# EasyEDA Pro project WukongY003.eprj, schematic PT32Y003_DEMO

## Sheets
1 P1: Create Date: 2022-10-31; Page Name: P1; Project Name: WukongY003; Schematic Name: PT32Y003_DEMO; Update Date: 2022-12-28; Company: PAI-IC; Drawed: THEli; Page Size: A4; Version: V1.0
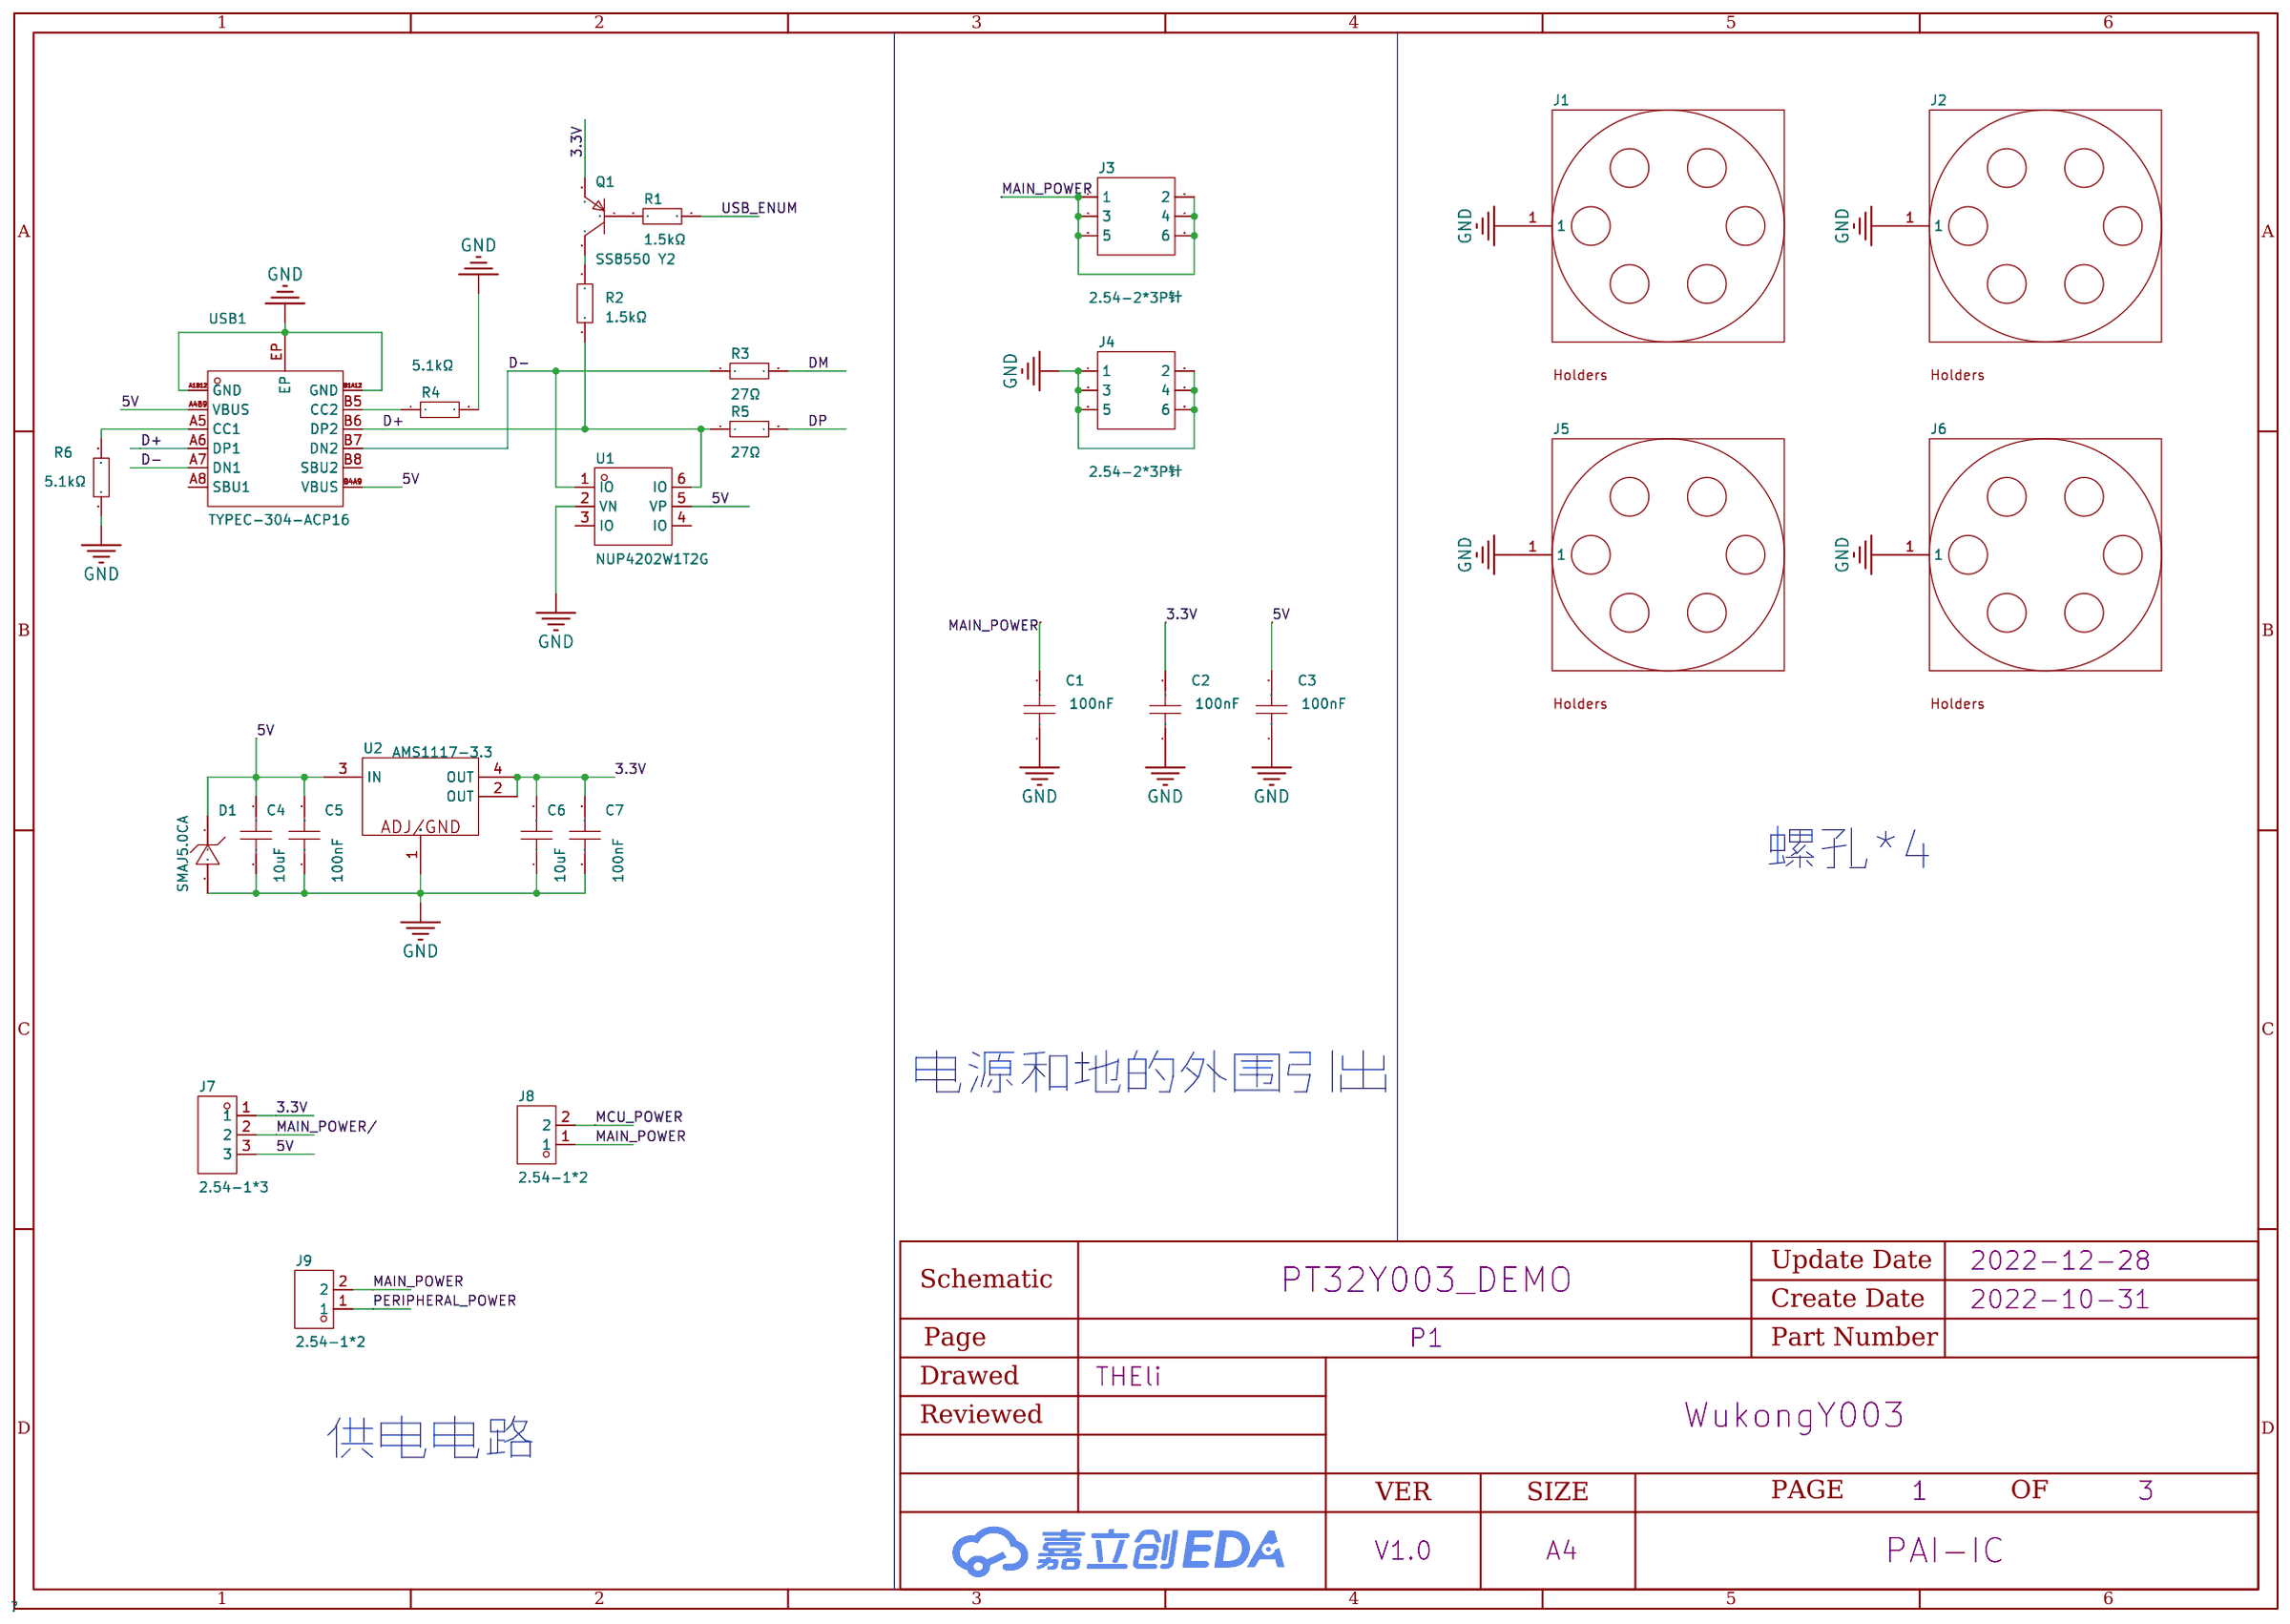
[diagram p0: P1]
2 P2: Create Date: 2022-11-01; Page Name: P2; Update Date: 2022-12-19; Company: 嘉立创EDA
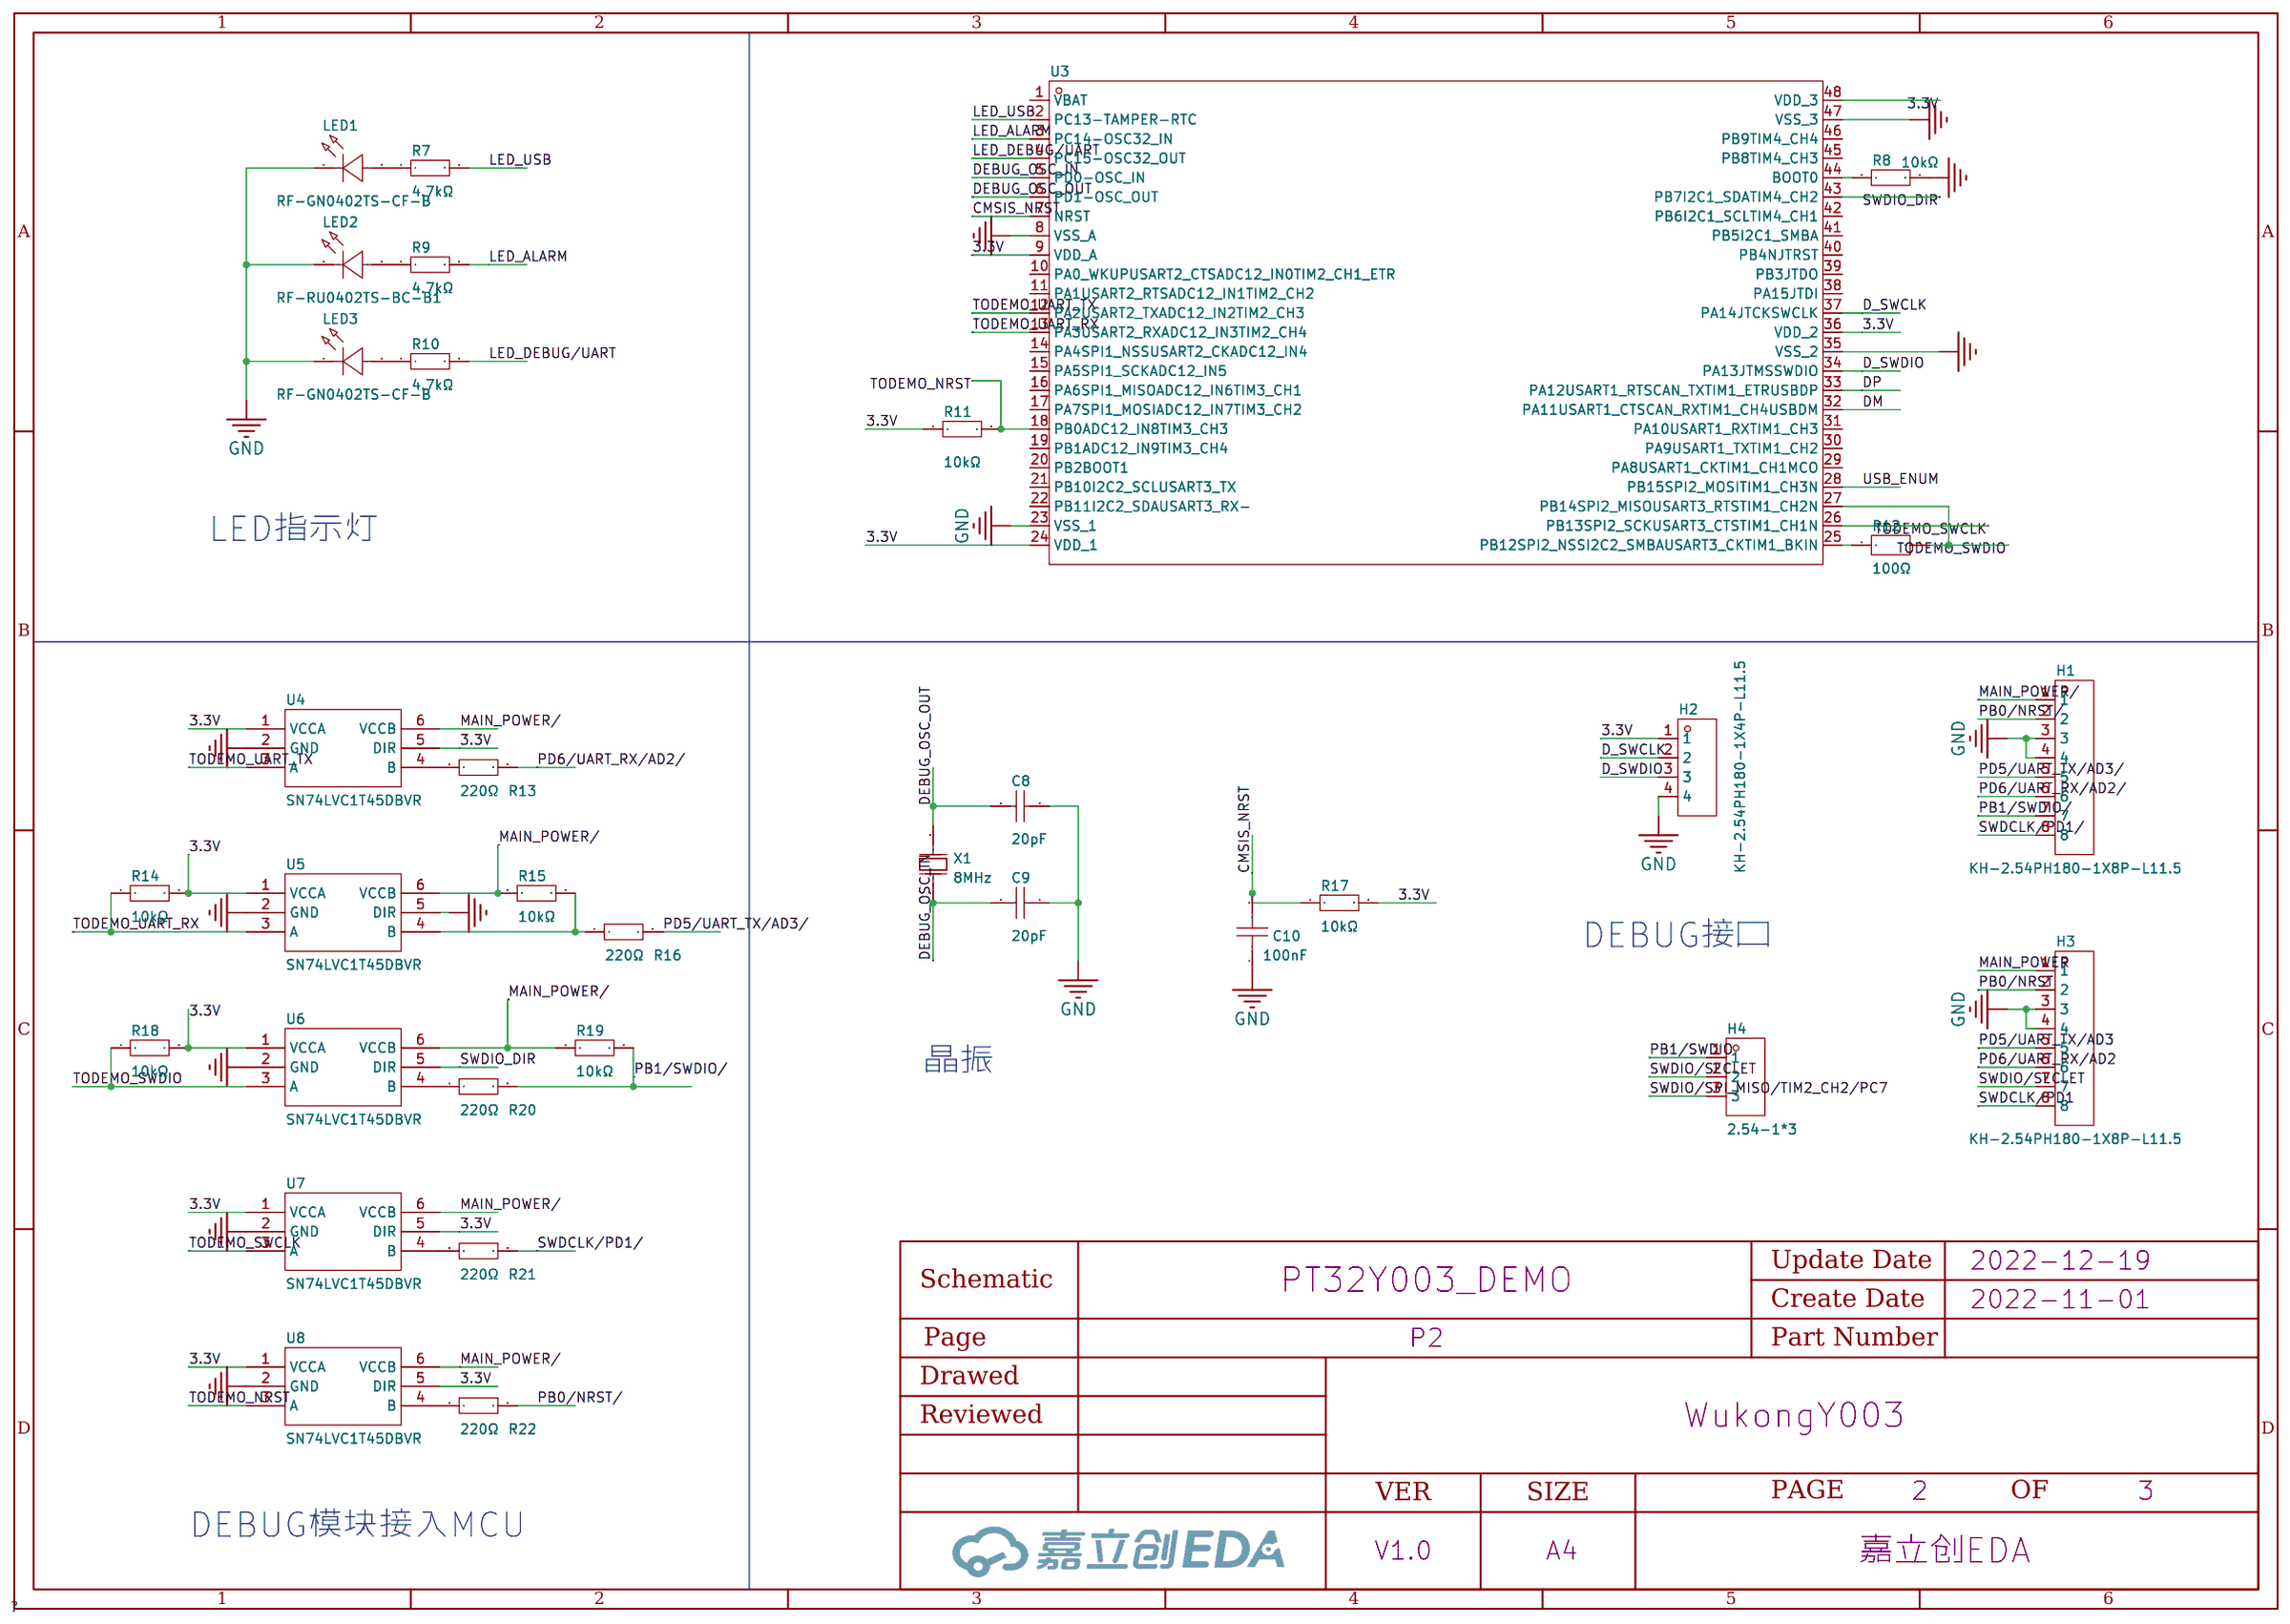
[diagram p1: P2]
3 P3: Create Date: 2022-11-08; Page Name: P3; Update Date: 2022-11-29; Company: 嘉立创EDA
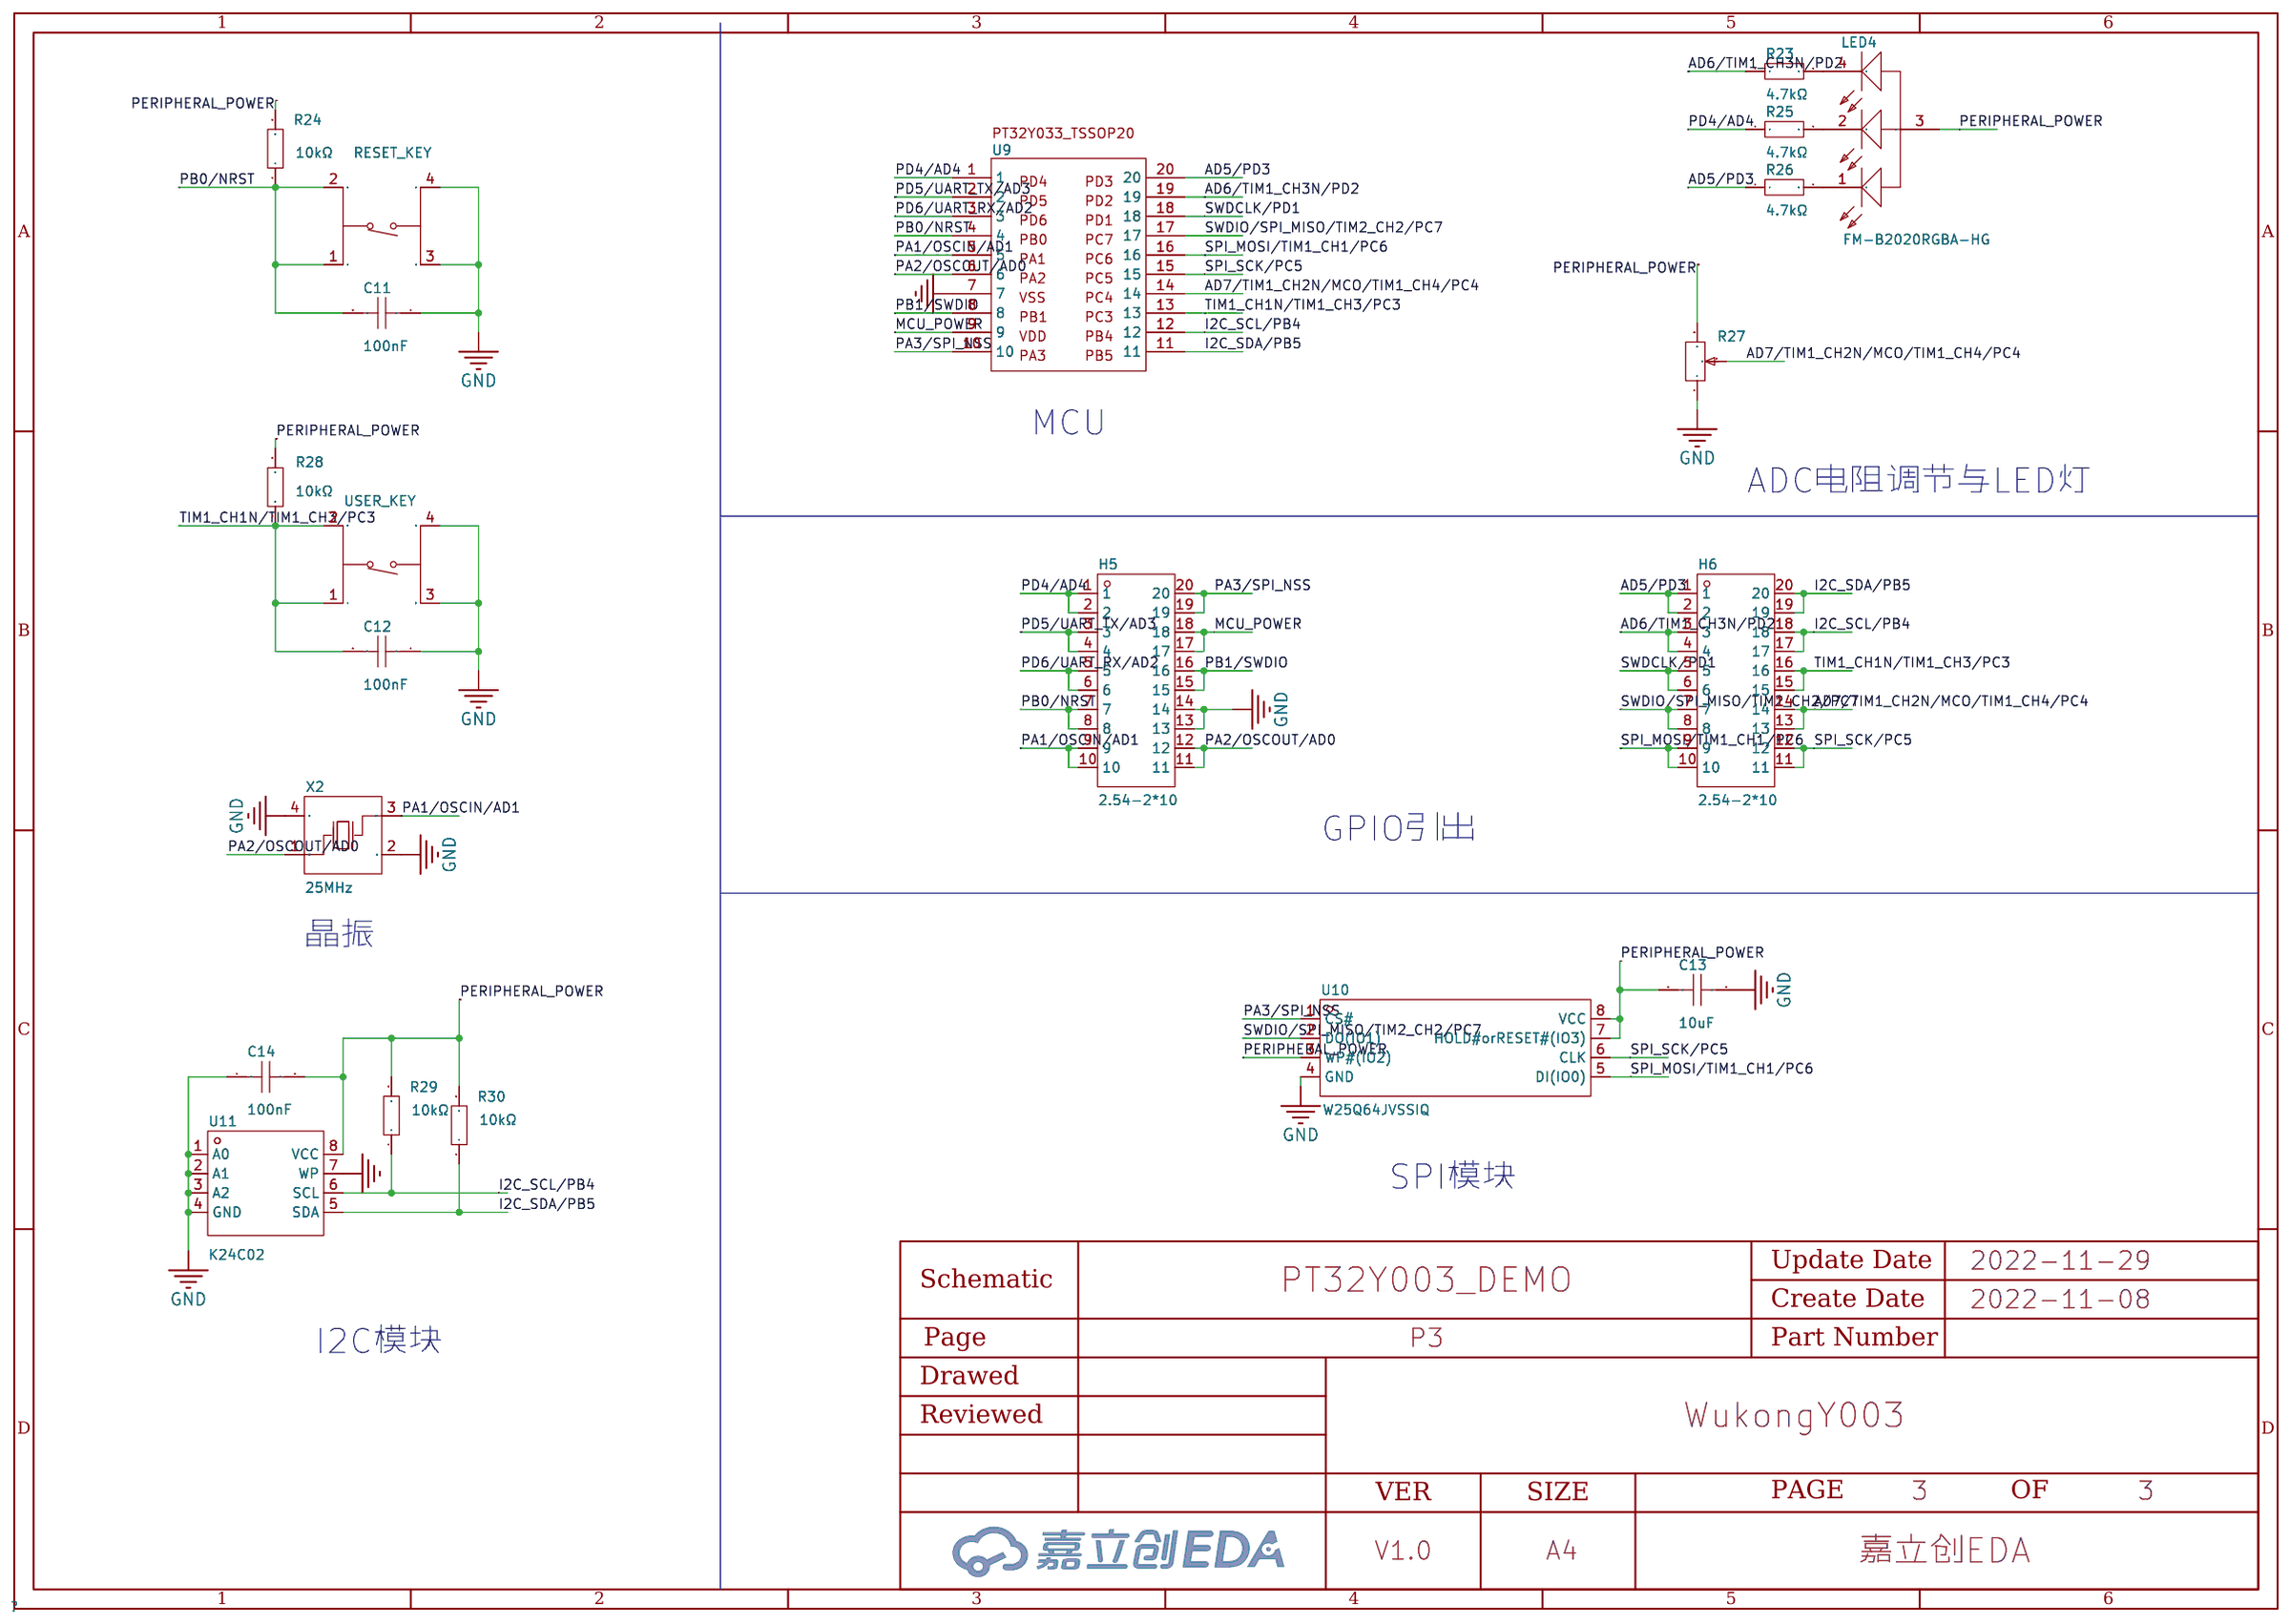
[diagram p2: P3]

## Parts
sheet P1
C1  100nF  [C0603]
C2  100nF  [C0603]
C3  100nF  [C0603]
C4  10uF  [C1210]
C5  100nF  [C0603]
C6  10uF  [C1210]
C7  100nF  [C0603]
D1  SMAJ5.0CA  [SMA_L4.3-W2.7-LS4.7-RD]
J1  -  [DEMO板安装孔]
J2  -  [DEMO板安装孔]
J3  2.54-2*3P针  [HDR-TH_6P-P2.54-V-M-R2-C3-S2.54-1]
J4  2.54-2*3P针  [HDR-TH_6P-P2.54-V-M-R2-C3-S2.54-1]
J5  -  [DEMO板安装孔]
J6  -  [DEMO板安装孔]
J7  2.54-1*3  [HDR-TH_3P-P2.54-V-M-1]
J8  2.54-1*2  [HDR-TH_2P-P2.54-V-M]
J9  2.54-1*2  [HDR-TH_2P-P2.54-V-M]
Q1  SS8550 Y2  [SOT-23-3_L2.9-W1.3-P1.90-LS2.4-BR]
R1  1.5kΩ  [R0603]
R2  1.5kΩ  [R0603]
R3  27Ω  [R0603]
R4  5.1kΩ  [R0603]
R5  27Ω  [R0603]
R6  5.1kΩ  [R0603]
U1  NUP4202W1T2G  [SOT-363_L2.0-W1.3-P0.65-LS2.1-BR]
U2  AMS1117-3.3  [SOT-223-3_L6.4-W3.5-P2.30-LS7.0-BR]
USB1  TYPEC-304-ACP16  [USB-C-SMD_TYPE-C-16P-1]
sheet P2
C8  20pF  [C0603]
C9  20pF  [C0603]
C10  100nF  [C0603]
H1  KH-2.54PH180-1X8P-L11.5  [HDR-TH_8P-P2.54-V-M]
H2  KH-2.54PH180-1X4P-L11.5  [HDR-TH_4P-P2.54-V-M]
H3  KH-2.54PH180-1X8P-L11.5  [HDR-TH_8P-P2.54-V-M]
H4  2.54-1*3  [HDR-TH_3P-P2.54-V-M-1]
LED1  RF-GN0402TS-CF-B  [LED0402-RD_GREEN]
LED2  RF-RU0402TS-BC-B1  [LED0402-RD_RED]
LED3  RF-GN0402TS-CF-B  [LED0402-RD_GREEN]
R7  4.7kΩ  [R0603]
R8  10kΩ  [R0603]
R9  4.7kΩ  [R0603]
R10  4.7kΩ  [R0603]
R11  10kΩ  [R0603]
R12  100Ω  [R0603]
R13  220Ω  [R0603]
R14  10kΩ  [R0603]
R15  10kΩ  [R0603]
R16  220Ω  [R0603]
R17  10kΩ  [R0603]
R18  10kΩ  [R0603]
R19  10kΩ  [R0603]
R20  220Ω  [R0603]
R21  220Ω  [R0603]
R22  220Ω  [R0603]
U3  STM32F103CBT6  [LQFP-48_L7.0-W7.0-P0.50-LS9.0-BL]
U4  SN74LVC1T45DBVR  [SOT-23-6_L2.9-W1.6-P0.95-LS2.8-BR]
U5  SN74LVC1T45DBVR  [SOT-23-6_L2.9-W1.6-P0.95-LS2.8-BR]
U6  SN74LVC1T45DBVR  [SOT-23-6_L2.9-W1.6-P0.95-LS2.8-BR]
U7  SN74LVC1T45DBVR  [SOT-23-6_L2.9-W1.6-P0.95-LS2.8-BR]
U8  SN74LVC1T45DBVR  [SOT-23-6_L2.9-W1.6-P0.95-LS2.8-BR]
X1  8MHz  [CRYSTAL-SMD_L5.0-W3.2]
sheet P3
C11  100nF  [C0603]
C12  100nF  [C0603]
C13  10uF  [C1210]
C14  100nF  [C0603]
H5  2.54-2*10  [HDR-TH_20P-P2.54-V-M-R2-C10-S2.54]
H6  2.54-2*10  [HDR-TH_20P-P2.54-V-M-R2-C10-S2.54]
LED4  FM-B2020RGBA-HG  [LED-SMD_FM-B2020RGBA-HG]
R23  4.7kΩ  [R0603]
R24  10kΩ  [R0603]
R25  4.7kΩ  [R0603]
R26  4.7kΩ  [R0603]
R27  环保  3362P-1-101LF  [RES-ADJ-TH_3362P]
R28  10kΩ  [R0603]
R29  10kΩ  [R0603]
R30  10kΩ  [R0603]
RESET_KEY  1TS001G-2500-1500-CT  [SW-SMD_4P-L5.1-W5.1-P3.70-LS6.5-TL-2]
U9  -  [TSSOP-20_L6.5-W4.4-P0.65-LS6.4-BL]
U10  W25Q64JVSSIQ  [SOIC-8_L5.3-W5.3-P1.27-LS8.0-BL]
U11  K24C02  [SOIC-8_L4.9-W3.9-P1.27-LS6.0-BL]
USER_KEY  1TS001G-2500-1500-CT  [SW-SMD_4P-L5.1-W5.1-P3.70-LS6.5-TL-2]
X2  25MHz  [OSC-SMD_4P-L3.2-W2.5-BL]

## Library data of the parts
C1-C3 C5 C7 C14 = CC0603KRX7R9BB104: 容值:100nF;精度:±10%;额定电压:50V;材质(温度系数):X7R;; LCSC Part Name: 100nF ±10% 50V; Supplier Part: C14663; Manufacturer: YAGEO(国巨); Supplier Footprint: 0603; JLCPCB Part Class: 基础库; Datasheet: https://atta.szlcsc.com/upload/public/pdf/source/20170116/1484561234239.pdf; Supplier: LCSC; Tolerance: ±10%; Voltage Rated: 50V; Temperature Coefficient: X7R
C4 C6 C13 = C3225X7R1H106KT000E: 容值:10uF;精度:±10%;额定电压:50V;材质(温度系数):X7R;; LCSC Part Name: 10uF ±10% 50V; Supplier Part: C432929; Manufacturer: TDK; Supplier Footprint: 1210; JLCPCB Part Class: 扩展库; Datasheet: https://atta.szlcsc.com/upload/public/pdf/source/20190927/C432929_36E2D8B1963F647950F6B7BECE2D0069.pdf; Supplier: LCSC; Tolerance: ±10%; Voltage Rated: 50V; Temperature Coefficient: X7R
D1 = SMAJ5.0CA: 极性:双向;反向截止电压(Vrwm):5V;击穿电压(最小值):6.4V;击穿电压(最大值):7.07V;反向漏电流(Ir):800A;峰值脉冲电流(Ipp)@10/1000s:43.5A;最大钳位电压:9.2V;峰值脉冲功率(Ppp)@10/1000s:400W;; LCSC Part Name: 双向 5V 400W; Supplier Part: C575836; Manufacturer: Me-TECH(美台高科); Supplier Footprint: SMA; JLCPCB Part Class: 扩展库; Datasheet: https://atta.szlcsc.com/upload/public/pdf/source/20200330/C501770_F7A6FC54E4D5C7A22C16B75BE7982739.pdf; Supplier: LCSC; Polarity: 双向; Reverse Stand-Off Voltage (Vrwm): 5V; Breakdown Voltage (Min): 6.4V; Breakdown Voltage (Max): 7.07V; Reverse Leakage Current (Ir): 800A; Peak Pulse Current (Ipp)@10/1000μs: 43.5A; Maximum Clamping Voltage: 9.2V; Peak Pulse Power Dissipation (Ppp)@10/1000μs: 400W
J1 J2 J5 J6 = 螺孔_3.1X6MM
J3 J4 = 2.54-2*3P针: 间距:2.54mm;总PIN位数:6;排数:2;插针结构:-;行距:-;安装类型:直插;圆针/方针:-;额定电流:-;额定电压:-;配合针长度:-;塑高:-;触头材质:-;触头镀层:-;颜色:黑色;; LCSC Part Name: 2.54mm 直插; Supplier Part: C65114; Manufacturer: BOOMELE(博穆精密); Supplier Footprint: 直插,P=2.54mm; JLCPCB Part Class: 扩展库; Datasheet: https://atta.szlcsc.comnull; Supplier: LCSC; Pitch: 2.54mm; Number of Pins: 6; Number of Rows: 2; Mounting Type: 直插; Color: 黑色
H4 J7 = 2.54-1*3: 排针 2.54mm 1x3P 镀金3u; LCSC Part Name: 排针 2.54mm 1x3P 镀金3u"; Supplier Part: C5116482; Manufacturer: ZHOURI(洲日); Supplier Footprint: 直插,P=2.54mm; Datasheet: https://atta.szlcsc.com/upload/public/pdf/source/20220729/4DB71EF9013296CFACD97372BAB8A1F0.pdf; Supplier: LCSC
J8 J9 = 2.54-1*2: 排针 2.54mm 1x2P 镀金3u; LCSC Part Name: 排针 2.54mm 1x2P 镀金3u"; Supplier Part: C5116481; Manufacturer: ZHOURI(洲日); Supplier Footprint: 直插,P=2.54mm; Datasheet: https://atta.szlcsc.com/upload/public/pdf/source/20220729/DF18AADA08AA3A4F1D3B0508BB8F7248.pdf; Supplier: LCSC
Q1 = SS8550 Y2_C8542: 晶体管类型:PNP;集射极击穿电压(Vceo):25V;集电极电流(Ic):1.5A;功率(Pd):300mW;集电极-发射极饱和电压(VCE(sat)@Ic,Ib):500mV@800mA,80mA;直流电流增益(hFE@Ic,Vce):200@100mA,1V;特征频率(fT):100MHz;工作温度:+150@(Tj);; LCSC Part Name: SS8550 Y2 200-350 Y2 200-350; Supplier Part: C8542; Manufacturer: CJ(江苏长电/长晶); Supplier Footprint: SOT-23(SOT-23-3); JLCPCB Part Class: 基础库; Datasheet: https://atta.szlcsc.com/upload/public/pdf/source/20140809/1457707214734.pdf; Supplier: LCSC; Transistor Type: PNP; Collector-Emitter Breakdown Voltage (Vceo): 25V; Collector Current (Ic): 1.5A; Power Dissipation (Pd): 300mW; Collector-Emitter Saturation Voltage (VCE(sat)@Ic,Ib): 500mV@800mA,80mA; DC Current Gain (hFE@Ic,Vce): 200@100mA,1V; Transition Frequency (fT): 100MHz; Operating Temperature: +150@(Tj)
R1 R2 = 0603WAF1501T5E: 阻值:1.5kΩ;精度:±1%;温度系数:±100ppm/;功率:1/10W;最大工作电压:75V;工作温度范围:-55~+155;; LCSC Part Name: 1.5KΩ ±1%; Supplier Part: C22843; Manufacturer: UNI-ROYAL(厚声); Supplier Footprint: 0603; JLCPCB Part Class: 基础库; Datasheet: https://atta.szlcsc.com/upload/public/pdf/source/20170920/C22843_1505887489783980640.pdf; Supplier: LCSC; Tolerance: ±1%; Temperature Coefficient: ±100ppm/; Power(Watts): 1/10W; Overload Voltage (Max): 75V; Operating Temperature Range: -55~+155
R3 R5 = 0603WAF270JT5E: 电阻类型:厚膜电阻;阻值:27Ω;精度:±1%;功率:100mW;温度系数:±200ppm/;最大工作电压:75V;工作温度范围:-55~+155;; LCSC Part Name: 27Ω ±1% 100mW; Supplier Part: C25190; Manufacturer: UNI-ROYAL(厚声); Supplier Footprint: 0603; JLCPCB Part Class: 基础库; Datasheet: https://atta.szlcsc.com/upload/public/pdf/source/20200306/C422600_1E6D84923E4A46A82E41ADD87F860B5C.pdf; Supplier: LCSC; Type: 厚膜电阻; Tolerance: ±1%; Power(Watts): 100mW; Temperature Coefficient: ±200ppm/; Overload Voltage (Max): 75V; Operating Temperature Range: -55~+155
R4 R6 = RMC1/16-512JTP: 阻值:5.1kΩ;精度:±5%;功率:100mW;温度系数:±200ppm/;; LCSC Part Name: 5.1kΩ ±5% 100mW; Supplier Part: C340473; Manufacturer: KAMAYA(釜屋電機); Supplier Footprint: 0603; JLCPCB Part Class: 扩展库; Datasheet: https://atta.szlcsc.com/upload/public/pdf/source/20181204/C340473_BED96FC8B40C7774F3C7A48B8B7BB147.pdf; Supplier: LCSC; Tolerance: ±5%; Power(Watts): 100mW; Temperature Coefficient: ±200ppm/
U1 = NUP4202W1T2G: 极性:-;反向截止电压(Vrwm):5V@Max;击穿电压(最小值):6V;击穿电压(最大值):-;反向漏电流(Ir):-;峰值脉冲电流(Ipp)@10/1000s:-;最大钳位电压:14.5V@Typ;峰值脉冲功率(Ppp)@10/1000s:500W;; LCSC Part Name: Vrwm:5V@Max 500W; Supplier Part: C89319; Manufacturer: onsemi(安森美); Supplier Footprint: SOT-363; JLCPCB Part Class: 扩展库; Datasheet: https://atta.szlcsc.com/upload/public/pdf/source/20170120/1484891298961.PDF; Supplier: LCSC; Reverse Stand-Off Voltage (Vrwm): 5V@Max; Breakdown Voltage (Min): 6V; Maximum Clamping Voltage: 14.5V@Typ; Peak Pulse Power Dissipation (Ppp)@10/1000μs: 500W
U2 = AMS1117-3.3_C2992570: Supplier Part: C2992570; Manufacturer: 国芯佳品; Supplier Footprint: SOT-223; JLCPCB Part Class: 扩展库; Datasheet: https://atta.szlcsc.com/upload/public/pdf/source/20220729/0D21C21EC310E4778671BF6BAE438640.pdf; Supplier: LCSC
USB1 = TYPEC-304-ACP16: 连接器类型:-;标准:-;公母:-;触点数量:-;端口数量:-;安装方式:-;额定电流 - 电源:-;触头材质:-;触头镀层:-;工作温度范围:-;; Supplier Part: C2982555; Manufacturer: XUNPU(讯普); Supplier Footprint: SMD; JLCPCB Part Class: 扩展库; Datasheet: https://atta.szlcsc.com/upload/public/pdf/source/20220311/3C907F75E12F45E4EE7F73565AB9C294.pdf; Supplier: LCSC
C8 C9 = GRM1885C1H200JA01D: 容值:20pF;精度:±5%;额定电压:50V;材质(温度系数):C0G;; LCSC Part Name: 20pF ±5% 50V; Supplier Part: C77030; Manufacturer: muRata(村田); Supplier Footprint: 0603; JLCPCB Part Class: 扩展库; Datasheet: https://atta.szlcsc.com/upload/public/pdf/source/20180309/C77030_15205840682601422358.pdf; Supplier: LCSC; Tolerance: ±5%; Voltage Rated: 50V; Temperature Coefficient: C0G
C10-C12 = TCC0603X7R104K500CT: 容值:100nF;精度:±10%;额定电压:50V;材质(温度系数):X7R;; LCSC Part Name: 100nF ±10% 50V; Supplier Part: C282519; Manufacturer: CCTC(三环); Supplier Footprint: 0603; JLCPCB Part Class: 扩展库; Datasheet: https://atta.szlcsc.com/upload/public/pdf/source/20180917/C282519_8CE721FA29EE85BB321020B63D7877A0.pdf; Supplier: LCSC; Tolerance: ±10%; Voltage Rated: 50V; Temperature Coefficient: X7R
H1 H3 = KH-2.54PH180-1X8P-L11.5: 间距:2.54mm;总PIN位数:8;排数:1;插针结构:1x8P;行距:-;安装类型:直插;圆针/方针:方针;额定电流:3A;额定电压:-;配合针长度:6mm;塑高:2.5mm;端接针长度:3mm;触头材质:-;工作温度范围:-40~+105;颜色:黑色;; LCSC Part Name: 2.54mm 1x8P 直插 方针; Supplier Part: C2905487; Manufacturer: kinghelm(金航标); Supplier Footprint: 插件,P=2.54mm; JLCPCB Part Class: 扩展库; Datasheet: https://atta.szlcsc.com/upload/public/pdf/source/20211019/E207DA256892DEA6FC546F48FC628120.pdf; Supplier: LCSC; Pitch: 2.54mm; Number of Pins: 8; Number of Rows: 1; Pin Structure: 1x8P; Mounting Type: 直插; Circluar Pins/Square Pins: 方针; Current Rating (Max): 3A; Length of Mating Pin: 6mm; Insulation Height: 2.5mm; Length of End Connection Pin: 3mm; Operating Temperature Range: -40~+105; Color: 黑色
H2 = KH-2.54PH180-1X4P-L11.5: 间距:2.54mm;总PIN位数:4;排数:1;插针结构:1x4P;行距:-;安装类型:直插;圆针/方针:方针;额定电流:3A;额定电压:-;配合针长度:6mm;塑高:2.5mm;端接针长度:3mm;触头材质:-;工作温度范围:-40~+105;颜色:黑色;; LCSC Part Name: 2.54mm 1x4P 直插 方针; Supplier Part: C2905435; Manufacturer: kinghelm(金航标); Supplier Footprint: 插件,P=2.54mm; JLCPCB Part Class: 扩展库; Datasheet: https://atta.szlcsc.com/upload/public/pdf/source/20211019/06FD9EA041E66F176E900F61FE678D35.pdf; Supplier: LCSC; Pitch: 2.54mm; Number of Pins: 4; Number of Rows: 1; Pin Structure: 1x4P; Mounting Type: 直插; Circluar Pins/Square Pins: 方针; Current Rating (Max): 3A; Length of Mating Pin: 6mm; Insulation Height: 2.5mm; Length of End Connection Pin: 3mm; Operating Temperature Range: -40~+105; Color: 黑色
LED1 LED3 = RF-GN0402TS-CF-B: 发光颜色:翠绿;二极管配置:-;透镜颜色:-;主波长:-;峰值波长:-;色温:-;光通量(25时):-;测试电流:5mA;正向电压(VF):-;发光强度:-;功率:68mW;发光角度:140°;安装方式:正贴;工作温度:-40~+85;; LCSC Part Name: 翠绿 正贴; Supplier Part: C2908301; Manufacturer: Refond(瑞丰); Supplier Footprint: 0402; Datasheet: https://atta.szlcsc.com/upload/public/pdf/source/20211101/8609560D72BAFB64913FFF0F926AD61D.pdf; Supplier: LCSC; Emitted Color: 翠绿; Forward Current: 5mA; Power Dissipation: 68mW; Viewing Angle: 140°; Mounting Sytle: 正贴; Operating Temperature: -40~+85
LED2 = RF-RU0402TS-BC-B1: 发光颜色:红灯;二极管配置:-;透镜颜色:-;主波长:-;峰值波长:-;色温:-;光通量(25时):-;测试电流:5mA;正向电压(VF):-;发光强度:-;功率:48mW;发光角度:140°;安装方式:正贴;工作温度:-40~+85;; LCSC Part Name: 红灯 正贴; Supplier Part: C2908303; Manufacturer: Refond(瑞丰); Supplier Footprint: 0402; Datasheet: https://atta.szlcsc.com/upload/public/pdf/source/20211101/99B9E7AECBE4848F3C3055441D87AE22.pdf; Supplier: LCSC; Emitted Color: 红灯; Forward Current: 5mA; Power Dissipation: 48mW; Viewing Angle: 140°; Mounting Sytle: 正贴; Operating Temperature: -40~+85
R7 R9 R10 R23 R25 R26 = RS-03K4701FT: 阻值:4.7kΩ;精度:±1%;功率:100mW;温度系数:±100ppm/;最大工作电压:50V;工作温度范围:-55~+155;; LCSC Part Name: 4.7kΩ ±1%; Supplier Part: C116693; Manufacturer: FH(风华); Supplier Footprint: 0603; JLCPCB Part Class: 扩展库; Datasheet: https://atta.szlcsc.com/upload/public/pdf/source/20170717/C116693_1500269946159820728.pdf; Supplier: LCSC; Tolerance: ±1%; Power(Watts): 100mW; Temperature Coefficient: ±100ppm/; Overload Voltage (Max): 50V; Operating Temperature Range: -55~+155
R8 R11 R14 R15 R17-R19 R24 R28-R30 = RC0603JR-0710KL: 电阻类型:厚膜电阻;阻值:10kΩ;精度:±5%;功率:100mW;温度系数:±100ppm/;最大工作电压:75V;工作温度范围:-55~+125;; LCSC Part Name: 10kΩ ±5% 100mW; Supplier Part: C99198; Manufacturer: YAGEO(国巨); Supplier Footprint: 0603; JLCPCB Part Class: 扩展库; Datasheet: https://atta.szlcsc.com/upload/public/pdf/source/20181223/C99198_917934A193F41F77D9F7D214A8C79116.pdf; Supplier: LCSC; Type: 厚膜电阻; Tolerance: ±5%; Power(Watts): 100mW; Temperature Coefficient: ±100ppm/; Overload Voltage (Max): 75V; Operating Temperature Range: -55~+125
R12 = 0603 ±5% 100Ω: 电阻类型:厚膜电阻;阻值:100Ω;精度:±5%;功率:100mW;温度系数:±100ppm/;最大工作电压:75V;工作温度范围:-55~+155;; LCSC Part Name: 100Ω ±5% 100mW; Supplier Part: C2889393; Manufacturer: VO(翔胜); Supplier Footprint: 0603; JLCPCB Part Class: 扩展库; Datasheet: https://atta.szlcsc.com/upload/public/pdf/source/20210902/777BF6DFB3B29B13210374B07BC23D84.pdf; Supplier: LCSC; Type: 厚膜电阻; Tolerance: ±5%; Power(Watts): 100mW; Temperature Coefficient: ±100ppm/; Overload Voltage (Max): 75V; Operating Temperature Range: -55~+155
R13 R16 R20-R22 = RC0603FR-07220RL: 最大工作电压:75V;工作温度范围:-55~+155;电阻长:-;精度:±1%;电阻直径:-;电阻高:-;电阻宽:-;电阻类型:厚膜电阻;阻值:220Ω;温度系数:±100ppm/;功率:100mW;; LCSC Part Name: 220Ω ±1%; Supplier Part: C107696; Manufacturer: YAGEO(国巨); Supplier Footprint: 0603; JLCPCB Part Class: 扩展库; Datasheet: https://atta.szlcsc.com/upload/public/pdf/source/20170818/C107696_1503051114712895062.pdf; Supplier: LCSC; Overload Voltage (Max): 75V; Operating Temperature Range: -55~+155; Tolerance: ±1%; Type: 厚膜电阻; Temperature Coefficient: ±100ppm/; Power(Watts): 100mW
U3 = STM32F103CBT6: 主频（MAX):72MHz;工作电压:2V ~ 3.6V;; Supplier Part: C8304; Manufacturer: ST(意法半导体); Supplier Footprint: LQFP-48_7x7x05P; JLCPCB Part Class: 扩展库; Datasheet: https://atta.szlcsc.com/upload/public/pdf/source/20140724/1457707170379.pdf; Supplier: LCSC; Speed: 72MHz; Voltage - Supply (Vcc/Vdd): 2V ~ 3.6V; RAM Size: 20KB; Number of I/O: 37; A/D: 16x12bit; PWM: 13; UART/USART: 3 USART; I2C（SMBUS/PMBUS）: 2; USB Device: 1; CAN: 1
U4-U8 = SN74LVC1T45DBVR: SN74LVC1T45 具有可配置电压转换和三态输出的单位双电源总线收发器; Supplier Part: C7843; Manufacturer: TI(德州仪器); Supplier Footprint: SOT-23-6; JLCPCB Part Class: 扩展库; Datasheet: https://atta.szlcsc.com/upload/public/pdf/source/20140708/1457707144772.pdf; Supplier: LCSC
X1 = ECS-80-8-30Q-VY-TR: 频率:8MHz;频率公差:±30ppm;频率稳定度:±150ppm;负载电容:8pF;等效串联电阻(ESR):100Ω;工作温度:-40~+150;; LCSC Part Name: 8MHz ±30ppm 8pF; Supplier Part: C2450726; Manufacturer: ECS; Supplier Footprint: SMD-2; JLCPCB Part Class: 扩展库; Datasheet: https://atta.szlcsc.com/upload/public/pdf/source/20210417/FAD195D892329E158C8389B3F7E74E6A.pdf; Supplier: LCSC; Frequency Tolerance: ±30ppm; Frequency Stability: ±150ppm; Load Capacitance: 8pF; Equivalent Series Resistance (ESR): 100Ω; Operating Temperature: -40~+150
H5 H6 = 2.54-2*10: 排针 2*10 2.54 11.6 MMROHS; LCSC Part Name: 排针 2*10 2.54 11.6 MMROHS; Supplier Part: C5116480; Manufacturer: ZHOURI(洲日); Supplier Footprint: 直插,P=2.54mm; JLCPCB Part Class: 扩展库; Datasheet: https://atta.szlcsc.com/upload/public/pdf/source/20220412/C6BEA3D643D1CE07163CD717B50927E0.pdf; Supplier: LCSC
LED4 = FM-B2020RGBA-HG: 发光颜色:RGB三色;; LCSC Part Name: RGB三色; Supplier Part: C108793; Manufacturer: 国星光电; Supplier Footprint: SMD,2.1x2.1mm; JLCPCB Part Class: 扩展库; Datasheet: https://atta.szlcsc.com/upload/public/pdf/source/20180518/C108793_2518890ED811E900864AC79152D9E220.pdf; Supplier: LCSC; Emitted Color: RGB三色
R27 = 环保  3362P-1-101LF: 精度:±10%;温度系数:±250ppm/;; LCSC Part Name: 100Ω ±10% ±250ppm/; Supplier Part: C5045; Supplier Footprint: 3362P; JLCPCB Part Class: 扩展库; Datasheet: https://atta.szlcsc.com/upload/public/pdf/source/20130305/1457706599457.pdf; Supplier: LCSC
RESET_KEY USER_KEY = 1TS001G-2500-1500-CT: 触点电流:20mA;额定电压(DC):12V;电路结构:单刀单掷;安装方式:立贴;按钮形状:圆形按钮;带灯:-;开关长度:5.1mm;开关宽度:5.1mm;开关高度:0.3mm;; LCSC Part Name: 铜头按钮; Supplier Part: C318798; Manufacturer: HYP(鸿源精密); Supplier Footprint: SMD,5.1x5.1mm; JLCPCB Part Class: 扩展库; Datasheet: https://atta.szlcsc.com/upload/public/pdf/source/20200109/C318798_ABAABA250D0C3768944463BC30CBE99E.pdf; Supplier: LCSC; Contact Current: 20mA; Voltage Rating (DC): 12V; Circuit: 单刀单掷; Mounting Style: 立贴; Actuator Style: 圆形按钮; Switch Length: 5.1mm; Switch Width: 5.1mm; Switch Height: 0.3mm
U9 = PT32Y003_TSSOP20
U10 = W25Q64JVSSIQ: 存储器类型:-;存储器构架(格式):-;技术:-;存储器容量:-;时钟频率:-;存储器接口类型:-;; Supplier Part: C179171; Manufacturer: WINBOND(华邦); Supplier Footprint: SOIC-8; JLCPCB Part Class: 扩展库; Datasheet: https://atta.szlcsc.com/upload/public/pdf/source/20191218/C179171_92C5C91D0324539EDD8F1160D2E79C0F.pdf; Supplier: LCSC
U11 = K24C02_C10510: 2-Kbit(256 x 8bit)，I2C接口，工作电压：1.7V to 5.5V; Supplier Part: C10510; Manufacturer: 华虹宏力; Supplier Footprint: SOIC-8_150mil; JLCPCB Part Class: 扩展库; Datasheet: https://atta.szlcsc.com/upload/public/pdf/source/20170116/1484561232223.pdf; Supplier: LCSC
X2 = X322525MOB4SI: 晶振类型:贴片无源晶振;频率:25MHz;频率公差:±10ppm;频率稳定度:±30ppm;负载电容:12pF;工作温度:-40~+85;; LCSC Part Name: YSX321SL 25MHz ±10ppm 12pF; Supplier Part: C9006; Manufacturer: YXC(扬兴晶振); Supplier Footprint: SMD3225-4P; JLCPCB Part Class: 基础库; Datasheet: https://atta.szlcsc.com/upload/public/pdf/source/20210329/C112971_1F611BDC486E193C1706F6D8EB5AA189.pdf; Supplier: LCSC; Crystal Type: 贴片无源晶振; Frequency Tolerance: ±10ppm; Frequency Stability: ±30ppm; Load Capacitance: 12pF; Operating Temperature: -40~+85

## Nets
3.3V: C2.2 C6.2 C7.2 H2.1 J7.1 Q1.2(E) R11.1 R14.2 R17.2 R18.2 U2.2(OUT) U2.4(OUT) U3.9(VDD_A) U3.24(VDD_1) U3.36(VDD_2) U3.48(VDD_3) U4.1(VCCA) U4.5(DIR) U5.1(VCCA) U6.1(VCCA) U7.1(VCCA) U7.5(DIR) U8.1(VCCA) U8.5(DIR)
5V: C3.2 C4.2 C5.2 D1.1(C) J7.3 U1.5(VP) U2.3(IN) USB1.A4B9(VBUS) USB1.B4A9(VBUS)
GND: C1.1 C2.1 C3.1 C4.1 C5.1 C6.1 C7.1 C8.1 C9.1 C10.1 C11.1 C12.1 C13.2 C14.1 D1.2(A) H1.3 H1.4 H2.4 H3.3 H3.4 H5.13 H5.14 J1.1 J2.1 J4.1 J4.2 J4.3 J4.4 J4.5 J4.6 J5.1 J6.1 LED1.1(K) LED2.1(K) LED3.1(K) R4.2 R6.1 R8.2 R27.1 RESET_KEY.3(C) RESET_KEY.4(D) U1.2(VN) U2.1(ADJ/GND) U3.8(VSS_A) U3.23(VSS_1) U3.35(VSS_2) U3.47(VSS_3) U4.2(GND) U5.2(GND) U5.5(DIR) U6.2(GND) U7.2(GND) U8.2(GND) U9.7 U10.4(GND) U11.1(A0) U11.2(A1) U11.3(A2) U11.4(GND) U11.7(WP) USB1.A1B12(GND) USB1.B1A12(GND) USB1.EP USER_KEY.3(C) USER_KEY.4(D) X2.2(GND) X2.4(GND)
AD5/PD3: H6.1 H6.2 R26.1 U9.20
AD6/TIM1_CH3N/PD2: H6.3 H6.4 R23.1 U9.19
AD7/TIM1_CH2N/MCO/TIM1_CH4/PC4: H6.13 H6.14 R27.2 U9.14
CMSIS_NRST: C10.2 R17.1 U3.7(NRST)
D+: R2.1 R5.1 U1.6(IO) USB1.A6(DP1) USB1.B6(DP2)
D-: R3.1 U1.1(IO) USB1.A7(DN1) USB1.B7(DN2)
D_SWCLK: H2.2 U3.37(PA14JTCKSWCLK)
D_SWDIO: H2.3 U3.34(PA13JTMSSWDIO)
DEBUG_OSC_IN: C9.2 U3.5(PD0-OSC_IN) X1.1(In/Out)
DEBUG_OSC_OUT: C8.2 U3.6(PD1-OSC_OUT) X1.2(Out/In)
DM: R3.2 U3.32(PA11USART1_CTSCAN_RXTIM1_CH4USBDM)
DP: R5.2 U3.33(PA12USART1_RTSCAN_TXTIM1_ETRUSBDP)
I2C_SCL/PB4: H6.17 H6.18 R29.1 U9.12 U11.6(SCL)
I2C_SDA/PB5: H6.19 H6.20 R30.1 U9.11 U11.5(SDA)
LED_ALARM: R9.2 U3.3(PC14-OSC32_IN)
LED_DEBUG/UART: R10.2 U3.4(PC15-OSC32_OUT)
LED_USB: R7.2 U3.2(PC13-TAMPER-RTC)
MAIN_POWER: C1.2 H3.1 J3.1 J3.2 J3.3 J3.4 J3.5 J3.6 J8.1 J9.2
MAIN_POWER/: H1.1 J7.2 R15.1 R19.1 U4.6(VCCB) U5.6(VCCB) U6.6(VCCB) U7.6(VCCB) U8.6(VCCB)
MCU_POWER: H5.17 H5.18 J8.2 U9.9
PA1/OSCIN/AD1: H5.9 H5.10 U9.5 X2.3(OSC2)
PA2/OSCOUT/AD0: H5.11 H5.12 U9.6 X2.1(OSC1)
PA3/SPI_NSS: H5.19 H5.20 U9.10 U10.1(CS#)
PB0/NRST: C11.2 H3.2 H5.7 H5.8 R24.1 RESET_KEY.1(A) RESET_KEY.2(B) U9.4
PB0/NRST/: H1.2 R22.2
PB1/SWDIO: H4.1 H5.15 H5.16 U9.8
PB1/SWDIO/: H1.7 R19.2 R20.2
PD4/AD4: H5.1 H5.2 R25.1 U9.1
PD5/UART_TX/AD3: H3.5 H5.3 H5.4 U9.2
PD5/UART_TX/AD3/: H1.5 R16.2
PD6/UART_RX/AD2: H3.6 H5.5 H5.6 U9.3
PD6/UART_RX/AD2/: H1.6 R13.2
PERIPHERAL_POWER: C13.1 C14.2 J9.1 LED4.3(A) R24.2 R27.3 R28.2 R29.2 R30.2 U10.3(WP#(IO2)) U10.7(HOLD#orRESET#(IO3)) U10.8(VCC) U11.8(VCC)
SPI_MOSI/TIM1_CH1/PC6: H6.9 H6.10 U9.16 U10.5(DI(IO0))
SPI_SCK/PC5: H6.11 H6.12 U9.15 U10.6(CLK)
SWDCLK/PD1: H3.8 H6.5 H6.6 U9.18
SWDCLK/PD1/: H1.8 R21.2
SWDIO/SECLET: H3.7 H4.2
SWDIO/SPI_MISO/TIM2_CH2/PC7: H4.3 H6.7 H6.8 U9.17 U10.2(DO(IO1))
SWDIO_DIR: U3.43(PB7I2C1_SDATIM4_CH2) U6.5(DIR)
TIM1_CH1N/TIM1_CH3/PC3: C12.2 H6.15 H6.16 R28.1 U9.13 USER_KEY.1(A) USER_KEY.2(B)
TODEMO_NRST: R11.2 U3.18(PB0ADC12_IN8TIM3_CH3) U8.3(A)
TODEMO_SWCLK: U3.26(PB13SPI2_SCKUSART3_CTSTIM1_CH1N) U7.3(A)
TODEMO_SWDIO: R12.2 R18.1 U3.27(PB14SPI2_MISOUSART3_RTSTIM1_CH2N) U6.3(A)
TODEMO_UART_RX: R14.1 U3.13(PA3USART2_RXADC12_IN3TIM2_CH4) U5.3(A)
TODEMO_UART_TX: U3.12(PA2USART2_TXADC12_IN2TIM2_CH3) U4.3(A)
USB_ENUM: R1.2 U3.28(PB15SPI2_MOSITIM1_CH3N)
$1N19114: Q1.1(B) R1.1
$1N21265: Q1.3(C) R2.2
$1N43105: R4.1 USB1.B5(CC2)
$1N43548: R6.2 USB1.A5(CC1)
$2N1934: R12.1 U3.25(PB12SPI2_NSSI2C2_SMBAUSART3_CKTIM1_BKIN)
$2N4921: R13.1 U4.4(B)
$2N12506: R20.1 U6.4(B)
$2N12712: R22.1 U8.4(B)
$2N15422: R8.1 U3.44(BOOT0)
$2N18611: LED1.2(A) R7.1
$2N18724: LED2.2(A) R9.1
$2N18837: LED3.2(A) R10.1
$2N21012: R21.1 U7.4(B)
$2N29349: R15.2 R16.1 U5.4(B)
$3N25357: LED4.1(K) R26.2
$3N25358: LED4.2(K) R25.2
$3N25359: LED4.4(K) R23.2

Not connected (* = marked no-connect by the designer): U1 3(IO) 4(IO); U3 1(VBAT) 10(PA0_WKUPUSART2_CTSADC12_IN0TIM2_CH1_ETR) 11(PA1USART2_RTSADC12_IN1TIM2_CH2) 14(PA4SPI1_NSSUSART2_CKADC12_IN4) 15(PA5SPI1_SCKADC12_IN5) 16(PA6SPI1_MISOADC12_IN6TIM3_CH1) 17(PA7SPI1_MOSIADC12_IN7TIM3_CH2) 19(PB1ADC12_IN9TIM3_CH4) 20(PB2BOOT1) 21(PB10I2C2_SCLUSART3_TX) 22(PB11I2C2_SDAUSART3_RX-) 29(PA8USART1_CKTIM1_CH1MCO) 30(PA9USART1_TXTIM1_CH2) 31(PA10USART1_RXTIM1_CH3) 38(PA15JTDI) 39(PB3JTDO) 40(PB4NJTRST) 41(PB5I2C1_SMBA) 42(PB6I2C1_SCLTIM4_CH1) 45(PB8TIM4_CH3) 46(PB9TIM4_CH4); USB1 A8(SBU1) B8(SBU2)

## Notes on the sheets
sheet 1
- 螺孔*4
- 电源和地的外围引出
- 供电电路
sheet 2
- LED指示灯
- DEBUG接口
- 晶振
- DEBUG模块接入MCU
sheet 3
- MCU
- ADC电阻调节与LED灯
- GPIO引出
- 晶振
- SPI模块
- I2C模块
